# Altium schematic sheet HT7550.schdoc
size 51 x 35 mm
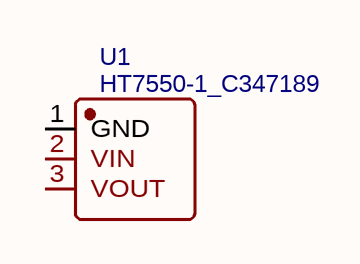
[diagram p0: HT7550.schdoc]

## Parts
U1  HT7550-1_C347189  [SOT-89_L4.5-W2.5-P1.50-LS4.2-BR]

## Nets

Not connected (* = marked no-connect by the designer): U1 1(GND) 2(VIN) 3(VOUT)

## Library data of the parts
U1 = HT7550-1_C347189: BOM_Manufacturer: Youtai Semiconductor Co., Ltd.; Contributor: LCSC; BOM_Supplier: LCSC; BOM_Supplier Part: C347189; BOM_Manufacturer Part: HT7550-1; BOM_JLCPCB Part Class: Extended Part; spicePre: U; spiceSymbolName: HT7550-1_C347189